# Altium project RK_MEGAPLATA.PrjPcb (part 3 of 9)
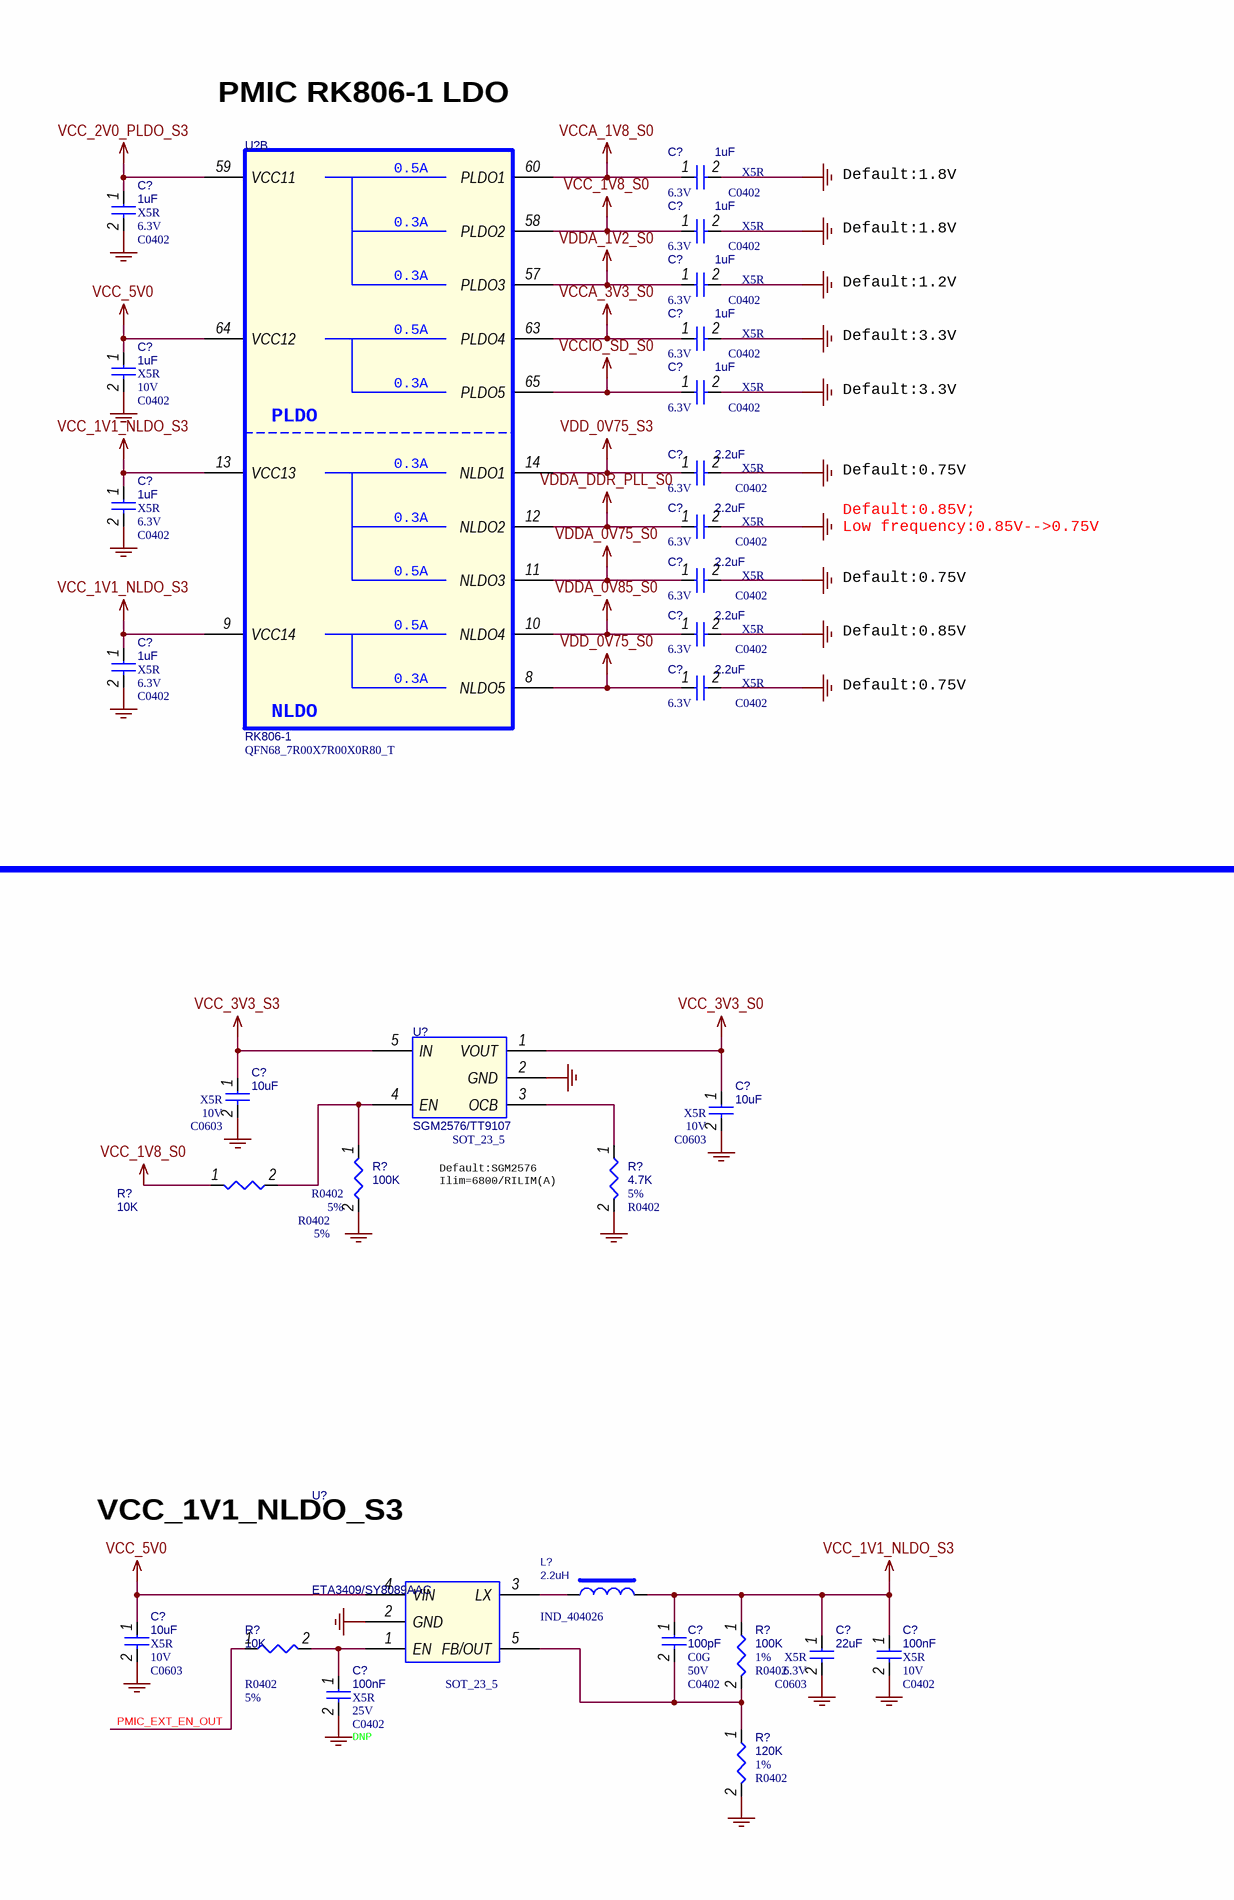
[diagram p26: POWER_RK806.SchDoc, right]

## Sheet POWER_RK806.SchDoc (continued)

### Parts
(Parts that share a designator on the sheet are numbered #1, #2 ... from top to bottom, then left to right.)
C?#85  10uF  Dielectric: X5R  Voltage: 10V  [C0603]
C?#86  22uF  Dielectric: X5R  Voltage: 10V  [C0805]
C?#87  22uF  Dielectric: X5R  Voltage: 6.3V  [C0603]
C?#88  22uF  Dielectric: X5R  Voltage: 6.3V  [C0603]
C?#89  10uF  Dielectric: X5R  Voltage: 6.3V  [C0603]
C?#90  1uF  Dielectric: X5R  Voltage: 10V  [C0402]
C?#91  47uF  Dielectric: X5R  Voltage: 6.3V  [C0805]
C?#92  47uF  Dielectric: X5R  Voltage: 6.3V  [C0805]
C?#93  22uF  Dielectric: X5R  Voltage: 6.3V  [C0603]
C?#94  22uF  Dielectric: X5R  Voltage: 6.3V  [C0603]
C?#95  1uF  Dielectric: X5R  Voltage: 10V  [C0402]
C?#96  10uF  Dielectric: X5R  Voltage: 10V  [C0603]
C?#97  22uF  Dielectric: X5R  Voltage: 10V  [C0805]
C?#98  1uF  Dielectric: X5R  Voltage: 6.3V  [C0402]
C?#99  1uF  Dielectric: X5R  Voltage: 6.3V  [C0402]
C?#100  1uF  Dielectric: X5R  Voltage: 6.3V  [C0402]
C?#101  22uF  Dielectric: X5R  Voltage: 6.3V  [C0603]
C?#102  22uF  Dielectric: X5R  Voltage: 6.3V  [C0603]
C?#103  10uF  Dielectric: X5R  Voltage: 6.3V  [C0603]
C?#104  1uF  Dielectric: X5R  Voltage: 10V  [C0402]
C?#105  22uF  Dielectric: X5R  Voltage: 6.3V  [C0603]
C?#106  22uF  Dielectric: X5R  Voltage: 6.3V  [C0603]
C?#107  22uF  Dielectric: X5R  Voltage: 6.3V  [C0603]
C?#108  22uF  Dielectric: X5R  Voltage: 6.3V  [C0603]
C?#109  100pF  Dielectric: C0G  Voltage: 50V  [C0402]
C?#110  1uF  Dielectric: X5R  Voltage: 6.3V  [C0402]
C?#111  1uF  Dielectric: X5R  Voltage: 6.3V  [C0402]
C?#112  1uF  Dielectric: X5R  Voltage: 10V  [C0402]
C?#113  1uF  Dielectric: X5R  Voltage: 6.3V  [C0402]
C?#114  10uF  Dielectric: X5R  Voltage: 10V  [C0603]
C?#115  22uF  Dielectric: X5R  Voltage: 10V  [C0805]
C?#116  2.2uF  Dielectric: X5R  Voltage: 6.3V  [C0402]
C?#117  1uF  Dielectric: X5R  Voltage: 6.3V  [C0402]
C?#118  22uF  Dielectric: X5R  Voltage: 6.3V  [C0603]
C?#119  22uF  Dielectric: X5R  Voltage: 6.3V  [C0603]
C?#120  10uF  Dielectric: X5R  Voltage: 6.3V  [C0603]
C?#121  2.2uF  Dielectric: X5R  Voltage: 6.3V  [C0402]
C?#122  100pF  Dielectric: C0G  Voltage: 50V  [C0402]
C?#123  22uF  Dielectric: X5R  Voltage: 6.3V  [C0603]
C?#124  22uF  Dielectric: X5R  Voltage: 6.3V  [C0603]
C?#125  22uF  Dielectric: X5R  Voltage: 6.3V  [C0603]
C?#126  22uF  Dielectric: X5R  Voltage: 6.3V  [C0603]
C?#127  1uF  Dielectric: X5R  Voltage: 10V  [C0402]
C?#128  2.2uF  Dielectric: X5R  Voltage: 6.3V  [C0402]
C?#129  2.2uF  Dielectric: X5R  Voltage: 6.3V  [C0402]
C?#130  1uF  Dielectric: X5R  Voltage: 6.3V  [C0402]
C?#131  2.2uF  Dielectric: X5R  Voltage: 6.3V  [C0402]
C?#132  10uF  Dielectric: X5R  Voltage: 10V  [C0603]
C?#133  22uF  Dielectric: X5R  Voltage: 10V  [C0805]
C?#134  22uF  Dielectric: X5R  Voltage: 6.3V  [C0603]
C?#135  22uF  Dielectric: X5R  Voltage: 6.3V  [C0603]
C?#136  1uF  Dielectric: X5R  Voltage: 10V  [C0402]
C?#137  22uF  Dielectric: X5R  Voltage: 6.3V  [C0603]
C?#138  22uF  Dielectric: X5R  Voltage: 6.3V  [C0603]
C?#139  22uF  Dielectric: X5R  Voltage: 6.3V  [C0603]
C?#140  22uF  Dielectric: X5R  Voltage: 6.3V  [C0603]
C?#141  10uF  Dielectric: X5R  Voltage: 10V  [C0603]
C?#142  10uF  Dielectric: X5R  Voltage: 10V  [C0603]
C?#143  22uF  Dielectric: X5R  Voltage: 6.3V  [C0603]
C?#144  22uF  Dielectric: X5R  Voltage: 6.3V  [C0603]
C?#145  22uF  Dielectric: X5R  Voltage: 6.3V  [C0603]
C?#146  22uF  Dielectric: X5R  Voltage: 6.3V  [C0603]
C?#147  10uF  Dielectric: X5R  Voltage: 10V  [C0603]
C?#148  10uF  Dielectric: X5R  Voltage: 10V  [C0603]
C?#149  22uF  Dielectric: X5R  Voltage: 10V  [C0805]
C?#150  22uF  Dielectric: X5R  Voltage: 10V  [C0805]
C?#151  22uF  Dielectric: X5R  Voltage: 10V  [C0805]
C?#152  22uF  Dielectric: X5R  Voltage: 10V  [C0805]
C?#153  1uF  Dielectric: X5R  Voltage: 10V  [C0402]
C?#154  22uF  Dielectric: X5R  Voltage: 6.3V  [C0603]
C?#155  22uF  Dielectric: X5R  Voltage: 6.3V  [C0603]
C?#156  22uF  Dielectric: X5R  Voltage: 6.3V  [C0603]
C?#157  22uF  Dielectric: X5R  Voltage: 6.3V  [C0603]
C?#158  22uF  Dielectric: X5R  Voltage: 6.3V  [C0603]
C?#159  1uF  Dielectric: X5R  Voltage: 10V  [C0402]
C?#160  47uF  Dielectric: X5R  Voltage: 6.3V  [C0805]
C?#161  47uF  Dielectric: X5R  Voltage: 6.3V  [C0805]
C?#162  22uF  Dielectric: X5R  Voltage: 6.3V  [C0603]
C?#163  22uF  Dielectric: X5R  Voltage: 6.3V  [C0603]
C?#164  22uF  Dielectric: X5R  Voltage: 6.3V  [C0603]
C?#165  10uF  Dielectric: X5R  Voltage: 10V  [C0603]
C?#166  100pF  Dielectric: C0G  Voltage: 50V  [C0402]
C?#167  22uF  Dielectric: X5R  Voltage: 6.3V  [C0603]
C?#168  100nF  Dielectric: X5R  Voltage: 10V  [C0402]
C?#169  100nF  Dielectric: X5R  Voltage: 25V  Option: DNP  [C0402]
C?#170  22uF  Dielectric: X5R  Voltage: 10V  [C0805]
C?#171  22uF  Dielectric: X5R  Voltage: 10V  [C0805]
C?#172  1uF  Dielectric: X5R  Voltage: 6.3V  [C0402]
C?#173  1uF  Dielectric: X5R  Voltage: 10V  [C0402]
C?#174  22uF  Dielectric: X5R  Voltage: 6.3V  [C0603]
C?#175  22uF  Dielectric: X5R  Voltage: 6.3V  [C0603]
C?#176  22uF  Dielectric: X5R  Voltage: 6.3V  [C0603]
C?#177  22uF  Dielectric: X5R  Voltage: 6.3V  [C0603]
C?#178  22uF  Dielectric: X5R  Voltage: 6.3V  [C0603]
C?#179  1uF  Dielectric: X5R  Voltage: 10V  [C0402]
C?#180  4.7uF  Dielectric: X5R  Voltage: 10V  [C0402]
C?#181  1nF  Dielectric: C0G  Voltage: 25V  [C0402]
C?#182  10nF  Dielectric: X5R  Voltage: 25V  [C0402]
C?#183  1nF  Dielectric: C0G  Voltage: 25V  [C0402]
C?#184  22uF  Dielectric: X5R  Voltage: 6.3V  [C0603]
D?#1  B5819WS  [SOD_323]
FB?  120R-100MHz  [L0603]
L?#1  0.47uH  [IND_201610]
L?#2  0.22uH  [IND_322512]
L?#3  0.47uH  [IND_201610]
L?#4  0.22uH  [IND_322512]
L?#5  0.47uH  [IND_201610]
L?#6  0.22uH  [IND_322512]
L?#7  0.47uH  [IND_201610]
L?#8  0.22uH  [IND_322512]
L?#9  0.47uH  [IND_201610]
L?#10  0.47uH  [IND_201610]
L?#11  0.22uH  [IND_322512]
L?#12  0.22uH  [IND_322512]
L?#13  2.2uH  [IND_404026]
L?#14  0.22uH  [IND_322512]
R?#41  100R  Tolerance: 5%  [R0402]
R?#42  100R  Tolerance: 5%  [R0402]
R?#43  120K  Tolerance: 1%  [R0402]
R?#44  100R  Tolerance: 5%  [R0402]
R?#45  100K  Tolerance: 1%  [R0402]
R?#46  20K  Tolerance: 1%  [R0402]
R?#47  100R  Tolerance: 5%  [R0402]
R?#48  100K  Tolerance: 1%  [R0402]
R?#49  100R  Tolerance: 5%  [R0402]
R?#50  0R  Tolerance: 5%  PCB Footprint: R0805  OPTION: DNP  [R0402]
R?#51  0R  Tolerance: 5%  PCB Footprint: R0805  [R0402]
R?#52  100K  Tolerance: 5%  [R0402]
R?#53  4.7K  Tolerance: 5%  [R0402]
R?#54  10K  Tolerance: 5%  [R0402]
R?#55  100R  Tolerance: 5%  [R0402]
R?#56  100R  Tolerance: 5%  [R0402]
R?#57  100K  Tolerance: 1%  [R0402]
R?#58  10K  Tolerance: 5%  [R0402]
R?#59  120K  Tolerance: 1%  [R0402]
R?#60  100K  Tolerance: 5%  [R0402]
R?#61  120K  Tolerance: 5%  [R0402]
R?#62  100K  Tolerance: 5%  [R0402]
R?#63  100K  Tolerance: 5%  option: DNP  [R0402]
R?#64  100R  Tolerance: 5%  [R0402]
R?#65  10K  Tolerance: 5%  [R0402]
R?#66  10K  Tolerance: 5%  [R0402]
R?#67  200K  Tolerance: 5%  [R0402]
R?#68  200K  Tolerance: 5%  [R0402]
U?#22  RK806-1  [QFN68_7R00X7R00X0R80_T]  (part A of 3)
U?#23  RK806-1  [QFN68_7R00X7R00X0R80_T]  (part B of 3)
U?#24  SGM2576/TT9107  [SOT_23_5]
U?#25  RK860-2  PCB Footprint: WLCSP20_1R65X2R05X0R63  [WLCSP-20]
U?#26  RK860-2  PCB Footprint: WLCSP20_1R65X2R05X0R63  [WLCSP-20]
U?#27  ETA3409/SY8089AAC  [SOT_23_5]
U?#28  RK806-1  [QFN68_7R00X7R00X0R80_T]  (part C of 3)
U?#29  RK860-3  PCB Footprint: WLCSP20_1R65X2R05X0R63  [WLCSP-20]

### Ports
CPU_BIG0_VSEL (out, see RK3588_OSC_PLL[4B]), CPU_BIG1_VSEL (out, see RK3588_OSC_PLL[3C]), I2C0_SCL_M2 (out, see RK3588_OSC_PLL[3C]), I2C0_SDA_M2 (see RK3588_OSC_PLL[3C]), I2C1_SCL_M2 (out, see RK3588_OSC_PLL[3C]), I2C1_SDA_M2 (see RK3588_OSC_PLL[3C]), NPU_VSEL (out, see RK3588_OSC_PLL[3C]), PMIC_INT_L (out, see RK3588_OSC_PLL[4B]), PMIC_PWR_CTRL1 (out, see RK3588_OSC_PLL[4B]), PMIC_PWR_CTRL2 (out, see RK3588_OSC_PLL[4C]), PMIC_PWR_CTRL3 (out, see RK3588_OSC_PLL[4C]), PMIC_SPI_CLK (out, see RK3588_OSC_PLL[4B]), PMIC_SPI_CS (out, see RK3588_OSC_PLL[4B]), PMIC_SPI_MOSI (see RK3588_OSC_PLL[4B]), PWRON_L (out, see BUTTON[2C]), RESET_L (in, see BUTTON[2B], RK3588_OSC_PLL[4A])

### Nets
GND: C?#85.2 C?#86.2 C?#87.2 C?#88.2 C?#89.2 C?#91.2 C?#92.2 C?#93.2 C?#94.2 C?#96.2 C?#97.2 C?#98.2 C?#99.2 C?#100.2 C?#101.2 C?#102.2 C?#103.2 C?#105.2 C?#106.2 C?#107.2 C?#108.2 C?#110.2 C?#111.2 C?#112.2 C?#113.2 C?#114.2 C?#115.2 C?#116.2 C?#117.2 C?#118.2 C?#119.2 C?#120.2 C?#121.2 C?#123.2 C?#124.2 C?#125.2 C?#126.2 C?#128.2 C?#129.2 C?#130.2 C?#131.2 C?#132.2 C?#133.2 C?#134.2 C?#135.2 C?#137.2 C?#138.2 C?#139.2 C?#140.2 C?#141.2 C?#142.2 C?#143.2 C?#144.2 C?#145.2 C?#146.2 C?#147.2 C?#148.2 C?#149.2 C?#150.2 C?#151.2 C?#152.2 C?#154.2 C?#155.2 C?#156.2 C?#157.2 C?#158.2 C?#160.2 C?#161.2 C?#162.2 C?#163.2 C?#164.2 C?#165.2 C?#167.2 C?#168.2 C?#169.2 C?#170.2 C?#171.2 C?#172.2 C?#174.2 C?#175.2 C?#176.2 C?#177.2 C?#178.2 C?#179.2 C?#181.2 C?#182.2 C?#183.2 C?#184.2 D?#1.1(A) R?#45.2 R?#48.2 R?#52.2 R?#53.2 R?#59.2 R?#61.2 R?#62.2 R?#63.2 R?#68.1 U?#24.2(GND) U?#25.B2(GND1) U?#25.B3(GND2) U?#25.B4(AGND) U?#25.C1(GND3) U?#25.C2(GND4) U?#25.C3(GND5) U?#25.C4(GND6) U?#26.B2(GND1) U?#26.B3(GND2) U?#26.B4(AGND) U?#26.C1(GND3) U?#26.C2(GND4) U?#26.C3(GND5) U?#26.C4(GND6) U?#27.2(GND) U?#28.69(ePAD) U?#29.B2(GND1) U?#29.B3(GND2) U?#29.B4(AGND) U?#29.C1(GND3) U?#29.C2(GND4) U?#29.C3(GND5) U?#29.C4(GND6)
VCC1V8_PMU_DDR_S3: R?#50.1 R?#51.1
VCC_1V1_NLDO_S3: C?#117.1 C?#130.1 C?#166.1 C?#167.1 C?#168.1 L?#13.2 R?#57.1 U?#23.9(VCC14) U?#23.13(VCC13)
VCC_1V8_S0: C?#100.1 R?#54.1 U?#23.58(PLDO2)
VCC_1V8_S3: C?#143.1 C?#144.1 L?#9.1 R?#51.2 R?#65.1 R?#66.1 U?#22.25(VOUT10)
VCC_1V8_S3_PLDO6: C?#172.1 R?#50.2 U?#28.20(VCCIO)
VCC_2V0_PLDO_S3: C?#99.1 C?#145.1 C?#146.1 L?#10.2 U?#22.41(VOUT7) U?#23.59(VCC11)
VCC_3V3_S0: C?#148.1 U?#24.1(VOUT)
VCC_3V3_S3: C?#134.1 C?#135.1 C?#147.1 L?#7.1 R?#60.1 U?#22.5(VOUT8) U?#24.5(IN)
VCC_5V0: C?#85.1 C?#86.1 C?#96.1 C?#97.1 C?#112.1 C?#114.1 C?#115.1 C?#132.1 C?#133.1 C?#141.1 C?#142.1 C?#149.1 C?#150.1 C?#151.1 C?#152.1 C?#165.1 C?#170.1 C?#171.1 C?#179.1 C?#180.1 U?#22.1(VCC9) U?#22.7(VCC8) U?#22.22(VCC4) U?#22.27(VCC10) U?#22.28(VCC6) U?#22.33(VCC2_1) U?#22.34(VCC2_2) U?#22.43(VCC7) U?#22.44(VCC5) U?#22.52(VCC1_1) U?#22.53(VCC1_2) U?#22.54(VCC3) U?#23.64(VCC12) U?#25.D1(VIN_1) U?#25.D2(VIN_2) U?#25.E1(VIN_3) U?#25.E2(VIN_4) U?#26.D1(VIN_1) U?#26.D2(VIN_2) U?#26.E1(VIN_3) U?#26.E2(VIN_4) U?#27.4(VIN) U?#28.21(VCCA) U?#29.D1(VIN_1) U?#29.D2(VIN_2) U?#29.E1(VIN_3) U?#29.E2(VIN_4)
VCCA_1V8_S0: C?#98.1 U?#23.60(PLDO1)
VCCA_3V3_S0: C?#111.1 U?#23.63(PLDO4)
VCCIO_SD_S0: C?#113.1 U?#23.65(PLDO5)
VDD2_DDR_S3: C?#101.1 C?#102.1 C?#103.1 C?#109.1 L?#3.1 R?#43.1 U?#22.30(VOUT6)
VDD_0V75_S0: C?#131.1 U?#23.8(NLDO5)
VDD_0V75_S3: C?#116.1 U?#23.14(NLDO1)
VDD_CPU_BIG0_S0: C?#153.1 C?#153.2 C?#154.1 C?#155.1 C?#156.1 C?#157.1 C?#158.1 L?#11.2 R?#55.1 R?#55.2 U?#25.A4(VOUT)
VDD_CPU_BIG1_MEM_S0: C?#184.1 FB?.2
VDD_CPU_BIG1_S0: C?#173.1 C?#173.2 C?#174.1 C?#175.1 C?#176.1 C?#177.1 C?#178.1 FB?.1 L?#14.2 R?#64.1 R?#64.2 U?#29.A4(VOUT)
VDD_CPU_LIT_S0: C?#104.1 C?#104.2 C?#105.1 C?#106.1 C?#107.1 C?#108.1 L?#4.2 R?#44.1 R?#44.2 U?#22.37(VOUT2)
VDD_DDR_S0: C?#87.1 C?#88.1 C?#89.1 C?#95.1 C?#95.2 L?#1.1 R?#41.1 R?#41.2 U?#22.46(VOUT5)
VDD_GPU_S0: C?#90.1 C?#90.2 C?#91.1 C?#92.1 C?#93.1 C?#94.1 L?#2.2 R?#42.1 R?#42.2 U?#22.49(VOUT1)
VDD_LOG_S0: C?#123.1 C?#124.1 C?#125.1 C?#126.1 C?#127.1 C?#127.2 L?#6.2 R?#47.1 R?#47.2 U?#22.56(VOUT3)
VDD_NPU_S0: C?#159.1 C?#159.2 C?#160.1 C?#161.1 C?#162.1 C?#163.1 C?#164.1 L?#12.2 R?#56.1 R?#56.2 U?#26.A4(VOUT)
VDD_VDENC_S0: C?#136.1 C?#136.2 C?#137.1 C?#138.1 C?#139.1 C?#140.1 L?#8.2 R?#49.1 R?#49.2 U?#22.24(VOUT4)
VDDA_0V75_S0: C?#128.1 U?#23.11(NLDO3)
VDDA_0V85_S0: C?#129.1 U?#23.10(NLDO4)
VDDA_1V2_S0: C?#110.1 U?#23.57(PLDO3)
VDDA_DDR_PLL_S0: C?#121.1 U?#23.12(NLDO2)  [project net (0.75-0.85V)]
VDDQ_DDR_S0: C?#118.1 C?#119.1 C?#120.1 C?#122.1 L?#5.1 R?#46.1 U?#22.67(VOUT9)
BIG/NPU_EN: R?#60.2 R?#61.1 U?#25.A2(EN) U?#26.A2(EN) U?#29.A2(EN)
CPU_BIG0_VSEL: U?#25.A1(VSEL) ; port CPU_BIG0_VSEL
CPU_BIG1_VSEL: U?#29.A1(VSEL) ; port CPU_BIG1_VSEL
I2C0_SCL_M2: U?#25.A3(SCL) U?#29.A3(SCL) ; port I2C0_SCL_M2
I2C0_SDA_M2: U?#25.B1(SDA) U?#29.B1(SDA) ; port I2C0_SDA_M2
I2C1_SCL_M2: U?#26.A3(SCL) ; port I2C1_SCL_M2
I2C1_SDA_M2: U?#26.B1(SDA) ; port I2C1_SDA_M2
NPU_VSEL: U?#26.A1(VSEL) ; port NPU_VSEL
PMIC_EXT_EN_OUT: R?#58.1 U?#28.39((~{M}/S)EXT_EN)
PMIC_FB6: C?#109.2 R?#43.2 R?#45.1 U?#22.31(FB6)
PMIC_FB9: C?#122.2 R?#46.2 R?#48.1 U?#22.66(FB9)
PMIC_INT_L: R?#65.2 U?#28.19(INT) ; port PMIC_INT_L
PMIC_PWR_CTRL1: U?#28.62(PWRCTRL1) ; port PMIC_PWR_CTRL1
PMIC_PWR_CTRL2: U?#28.61(PWRCTRL2) ; port PMIC_PWR_CTRL2
PMIC_PWR_CTRL3: U?#28.16((PWRCTRL3)SO) ; port PMIC_PWR_CTRL3
PMIC_SPI_CLK: U?#28.17((SCL)CLK) ; port PMIC_SPI_CLK
PMIC_SPI_CS: R?#62.1 U?#28.18((IIC/~{SPI})CS) ; port PMIC_SPI_CS
PMIC_SPI_MOSI: R?#63.1 U?#28.15((SDA)MOSI) ; port PMIC_SPI_MOSI
PMIC_SW1: L?#2.1 U?#22.50(SW1_1) U?#22.51(SW1_2)
PMIC_SW2: L?#4.1 U?#22.35(SW2_1) U?#22.36(SW2_2)
PMIC_SW3: L?#6.1 U?#22.55(SW3)
PMIC_SW4: L?#8.1 U?#22.23(SW4)
PMIC_SW5: L?#1.2 U?#22.45(SW5)
PMIC_SW6: L?#3.2 U?#22.29(SW6)
PMIC_SW7: L?#10.1 U?#22.42(SW7)
PMIC_SW8: L?#7.2 U?#22.6(SW8)
PMIC_SW9: L?#5.2 U?#22.68(SW9)
PMIC_SW10: L?#9.2 U?#22.26(SW10)
PMIC_VDC: C?#181.1 R?#67.1 R?#68.2 U?#28.32(VDC)
PWRON_L: C?#183.1 U?#28.4(PWRON) ; port PWRON_L
RESET_L: C?#182.1 R?#66.2 U?#28.40(RESETB) ; port RESET_L
NetC?#166_2: C?#166.2 R?#57.2 R?#59.1 U?#27.5(FB/OUT)
NetC?#169_1: C?#169.1 R?#58.2 U?#27.1(EN)
NetC?#180_2: C?#180.2 D?#1.2(K) R?#67.2
NetL?#11_1: L?#11.1 U?#25.D3(SW_1) U?#25.D4(SW_2) U?#25.E3(SW_3) U?#25.E4(SW_4)
NetL?#12_1: L?#12.1 U?#26.D3(SW_1) U?#26.D4(SW_2) U?#26.E3(SW_3) U?#26.E4(SW_4)
NetL?#13_1: L?#13.1 U?#27.3(LX)
NetL?#14_1: L?#14.1 U?#29.D3(SW_1) U?#29.D4(SW_2) U?#29.E3(SW_3) U?#29.E4(SW_4)
NetR?#52_1: R?#52.1 R?#54.2 U?#24.4(EN)
NetR?#53_1: R?#53.1 U?#24.3(OCB)

Not connected (* = marked no-connect by the designer): U?#22 38(FB2)* 47(FB5)* 48(FB1)*; U?#28 2(SYNC)* 3(SYNC_CLK)*

### Notes on the sheet
- PMIC RK806-1 BUCK
- Default:0.85V
  Low frequency:
  0.85V-->0.75V
- Feedback from RK3588
- PMIC RK806-1 LDO
- Default:1.8V
- Default:1.1V
- Default:1.2V
- LPDDR4/4x=1.1V
- LPDDR5=1.05V
- 110K
- 120K
- Default:3.3V
- OUT
- VDD
- FB
- 100R
- RK3588
- Default:0.6V
- Default:0.75V
- Default:0.85V;
  Low frequency:0.85V-->0.75V
- DCDC
- Default:0.85V
- LPDDR5=0.5V
- LPDDR4/4x=0.6V
- 0R
- 20K
- 100K
- DNP
- Default:2.0V
- Default:SGM2576
  Ilim=6800/RILIM(A)
- VDD_CPU_BIG0
- VDD_NPU
- VCC_1V1_NLDO_S3
- VDD_CPU_BIG1
- PMIC RK806-1 Managerment
- 594x841
- Формат А1
- (in symbol PMIC_RK806, part A) BUCK5 / 2.5A; BUCK1 / 6.5A; (FB=0.5V); BUCK6 / 2.5A; BUCK2 / 5A; BUCK9 / 2.5A; BUCK3 / 5A; BUCK8 / 2.5A; BUCK4 / 5A; BUCK10 / 2.5A; BUCK7 / 2.5A
- (in symbol PMIC_RK806, part B) 0.5A; 0.3A; PLDO; NLDO
- (in symbol PMIC_RK806, part C) PLDO6 / 300mA; 45K